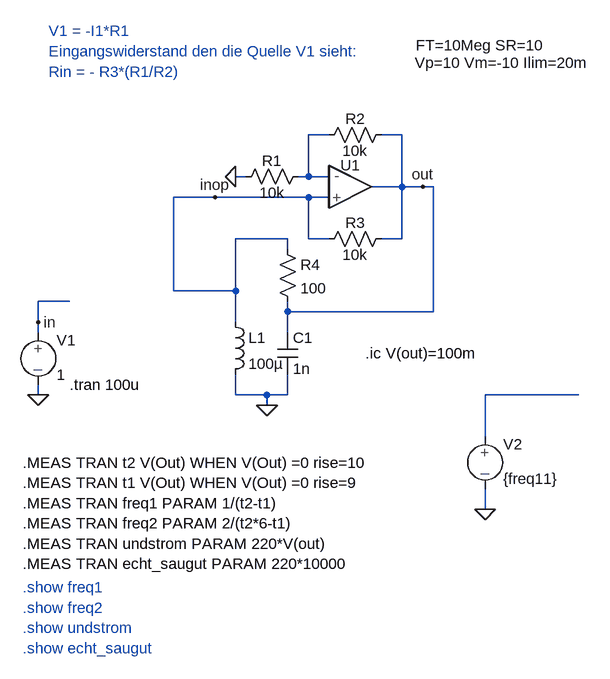
[diagram p0: schematic negativ_resistor.asc]
negativ_resistor.asc, the LTspice schematic file:
Version 4
SHEET 1 880 748
WIRE 320 -48 288 -48
WIRE 432 -48 400 -48
WIRE 192 16 176 16
WIRE 288 16 288 -48
WIRE 288 16 272 16
WIRE 320 16 288 16
WIRE 432 32 432 -48
WIRE 432 32 384 32
WIRE 464 32 432 32
WIRE 480 32 464 32
WIRE 144 48 80 48
WIRE 288 48 144 48
WIRE 320 48 288 48
WIRE 256 112 176 112
WIRE 288 112 288 48
WIRE 320 112 288 112
WIRE 432 112 432 32
WIRE 432 112 400 112
WIRE 256 128 256 112
WIRE 80 192 80 48
WIRE 176 192 176 112
WIRE 176 192 80 192
WIRE -80 208 -128 208
WIRE 256 224 256 208
WIRE 480 224 480 32
WIRE 480 224 256 224
WIRE -128 240 -128 208
WIRE 176 240 176 192
WIRE -128 256 -128 240
WIRE 256 256 256 224
WIRE -128 352 -128 336
WIRE 176 352 176 320
WIRE 224 352 176 352
WIRE 256 352 256 320
WIRE 256 352 224 352
WIRE 704 352 560 352
WIRE 224 368 224 352
WIRE 560 416 560 352
WIRE 560 528 560 496
FLAG -128 352 0
FLAG 176 16 0
FLAG 464 32 out
FLAG -128 240 in
FLAG 144 48 inop
FLAG 224 368 0
FLAG 560 528 0
SYMBOL EIT_Semiconductors\\op_3 352 32 R0
WINDOW 123 101 -218 Left 0
WINDOW 3 100 -191 Left 0
SYMATTR InstName U1
SYMBOL res 416 -64 R90
WINDOW 0 7 56 VBottom 0
WINDOW 3 25 56 VTop 0
SYMATTR InstName R2
SYMATTR Value 10k
SYMBOL res 288 0 R90
WINDOW 0 7 56 VBottom 0
WINDOW 3 25 56 VTop 0
SYMATTR InstName R1
SYMATTR Value 10k
SYMBOL res 304 128 R270
WINDOW 0 25 56 VTop 0
WINDOW 3 7 56 VBottom 0
SYMATTR InstName R3
SYMATTR Value 10k
SYMBOL source-V -128 240 R0
SYMATTR InstName V1
SYMATTR Value 1
SYMBOL ind 160 224 R0
SYMATTR InstName L1
SYMATTR Value 100µ
SYMBOL cap 240 256 R0
SYMATTR InstName C1
SYMATTR Value 1n
SYMBOL res 240 112 R0
SYMATTR InstName R4
SYMATTR Value 100
SYMBOL source-V 560 400 R0
WINDOW 123 0 0 Left 0
WINDOW 39 0 0 Left 0
SYMATTR InstName V2
SYMATTR Value {freq11}
TEXT -112 -208 Left 0 ;V1 = -I1*R1\nEingangswiderstand den die Quelle V1 sieht:\nRin = - R3*(R1/R2)
TEXT -80 336 Left 0 !.tran 100u
TEXT 376 288 Left 0 !.ic V(out)=100m
TEXT -152 456 Left 0 !.MEAS TRAN t2 V(Out) WHEN V(Out) =0 rise=10\n.MEAS TRAN t1 V(Out) WHEN V(Out) =0 rise=9\n.MEAS TRAN freq1 PARAM 1/(t2-t1)\n.MEAS TRAN freq2 PARAM 2/(t2*6-t1)\n.MEAS TRAN undstrom PARAM 220*V(out)\n.MEAS TRAN echt_saugut PARAM 220*10000
TEXT -152 648 Left 0 ;.show freq1\n.show freq2\n.show undstrom\n.show echt_saugut

The netlist it stands for:
* negativ_resistor.asc
XU1 inop N001 out opamp_param_3 Vp=10 Vm=-10 Ilim=20m FT=10Meg SR=10 Vos=0 A0=100k phir=45 en=0 enk=0 in=0 ink=0 Rin=500Meg  ; pins In+ In- OUT
R2 out N001 10k
R1 N001 0 10k
R3 inop out 10k
V1 in 0 1
L1 inop 0 100µ
C1 out 0 1n
R4 inop out 100
V2 N002 0 {freq11}
* V1 = -I1*R1
* Eingangswiderstand den die Quelle V1 sieht:
* Rin = - R3*(R1/R2)
.tran 100u
.ic V(out)=100m
.MEAS TRAN t2 V(Out) WHEN V(Out) =0 rise=10
.MEAS TRAN t1 V(Out) WHEN V(Out) =0 rise=9
.MEAS TRAN freq1 PARAM 1/(t2-t1)
.MEAS TRAN freq2 PARAM 2/(t2*6-t1)
.MEAS TRAN undstrom PARAM 220*V(out)
.MEAS TRAN echt_saugut PARAM 220*10000
* .show freq1
* .show freq2
* .show undstrom
* .show echt_saugut
.lib EIT_sub\opamp_parametrierbar.sub
.backanno
.end